# Altium project plexus_hand_sense_template.PrjPcb
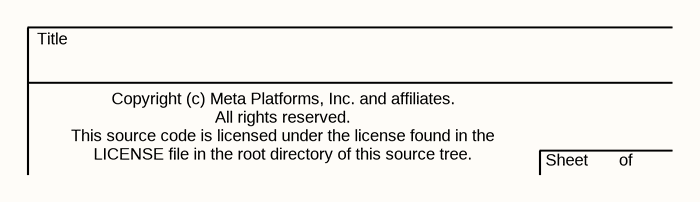
[diagram p0: SENSE.SchDoc]
3 sheets, 1 parts. Net scope: global (net labels, ports and power ports of the same name join across sheets).
Board file: plexus_hand_sense_template.PcbDoc
Sheets:
  SENSE.SchDoc
  SENSE_LOWER.SchDoc
  CONNECTOR.SchDoc

## Sheet SENSE.SchDoc
size C; SheetNumber: 1; SheetTotal: 3

### Notes on the sheet
- Title
- Copyright (c) Meta Platforms, Inc. and affiliates.
  All rights reserved.
  This source code is licensed under the license found in the
  LICENSE file in the root directory of this source tree.
- Sheet
- of

## Sheet SENSE_LOWER.SchDoc
size C; SheetNumber: 2; SheetTotal: 3
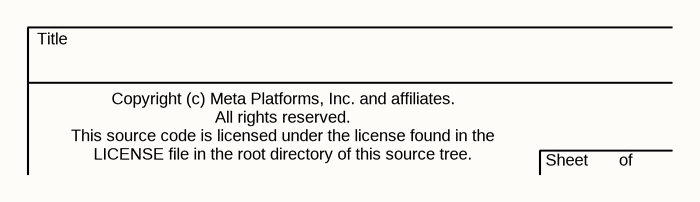
[diagram p1: SENSE_LOWER.SchDoc]

### Notes on the sheet
- Title
- Copyright (c) Meta Platforms, Inc. and affiliates.
  All rights reserved.
  This source code is licensed under the license found in the
  LICENSE file in the root directory of this source tree.
- Sheet
- of

## Sheet CONNECTOR.SchDoc
size Letter; SheetNumber: 3; SheetTotal: 3
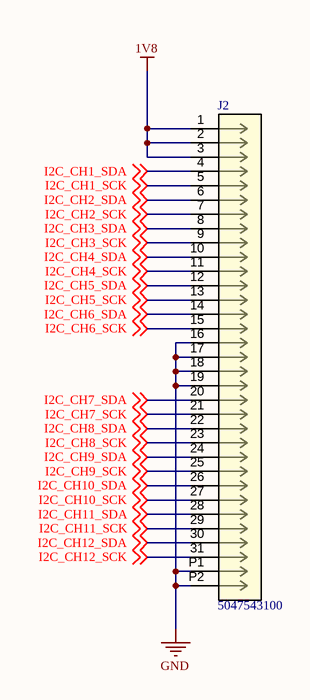
[diagram p2: CONNECTOR.SchDoc]

### Parts
J2  5047543100  [CON_5047543100_MOL]

### Nets
1V8: J2.1 J2.2 J2.3
GND: J2.16 J2.17 J2.18 J2.19 J2.P1 J2.P2
I2C_CH1_SCK: J2.5 ; off-sheet I2C_CH1_SCK
I2C_CH1_SDA: J2.4 ; off-sheet I2C_CH1_SDA
I2C_CH2_SCK: J2.7 ; off-sheet I2C_CH2_SCK
I2C_CH2_SDA: J2.6 ; off-sheet I2C_CH2_SDA
I2C_CH3_SCK: J2.9 ; off-sheet I2C_CH3_SCK
I2C_CH3_SDA: J2.8 ; off-sheet I2C_CH3_SDA
I2C_CH4_SCK: J2.11 ; off-sheet I2C_CH4_SCK
I2C_CH4_SDA: J2.10 ; off-sheet I2C_CH4_SDA
I2C_CH5_SCK: J2.13 ; off-sheet I2C_CH5_SCK
I2C_CH5_SDA: J2.12 ; off-sheet I2C_CH5_SDA
I2C_CH6_SCK: J2.15 ; off-sheet I2C_CH6_SCK
I2C_CH6_SDA: J2.14 ; off-sheet I2C_CH6_SDA
I2C_CH7_SCK: J2.21 ; off-sheet I2C_CH7_SCK
I2C_CH7_SDA: J2.20 ; off-sheet I2C_CH7_SDA
I2C_CH8_SCK: J2.23 ; off-sheet I2C_CH8_SCK
I2C_CH8_SDA: J2.22 ; off-sheet I2C_CH8_SDA
I2C_CH9_SCK: J2.25 ; off-sheet I2C_CH9_SCK
I2C_CH9_SDA: J2.24 ; off-sheet I2C_CH9_SDA
I2C_CH10_SCK: J2.27 ; off-sheet I2C_CH10_SCK
I2C_CH10_SDA: J2.26 ; off-sheet I2C_CH10_SDA
I2C_CH11_SCK: J2.29 ; off-sheet I2C_CH11_SCK
I2C_CH11_SDA: J2.28 ; off-sheet I2C_CH11_SDA
I2C_CH12_SCK: J2.31 ; off-sheet I2C_CH12_SCK
I2C_CH12_SDA: J2.30 ; off-sheet I2C_CH12_SDA

### Notes on the sheet
- Title
- Copyright (c) Meta Platforms, Inc. and affiliates.
  All rights reserved.
  This source code is licensed under the license found in the
  LICENSE file in the root directory of this source tree.
- Sheet
- of

### Library data of the parts
J2 = 5047543100: No Description Available; Mfr_Name: Molex Connector Corporation; RefDes: RefDes; Type: Type